# EAGLE schematic BT840F_Schematic (EAGLE 9.5.2)
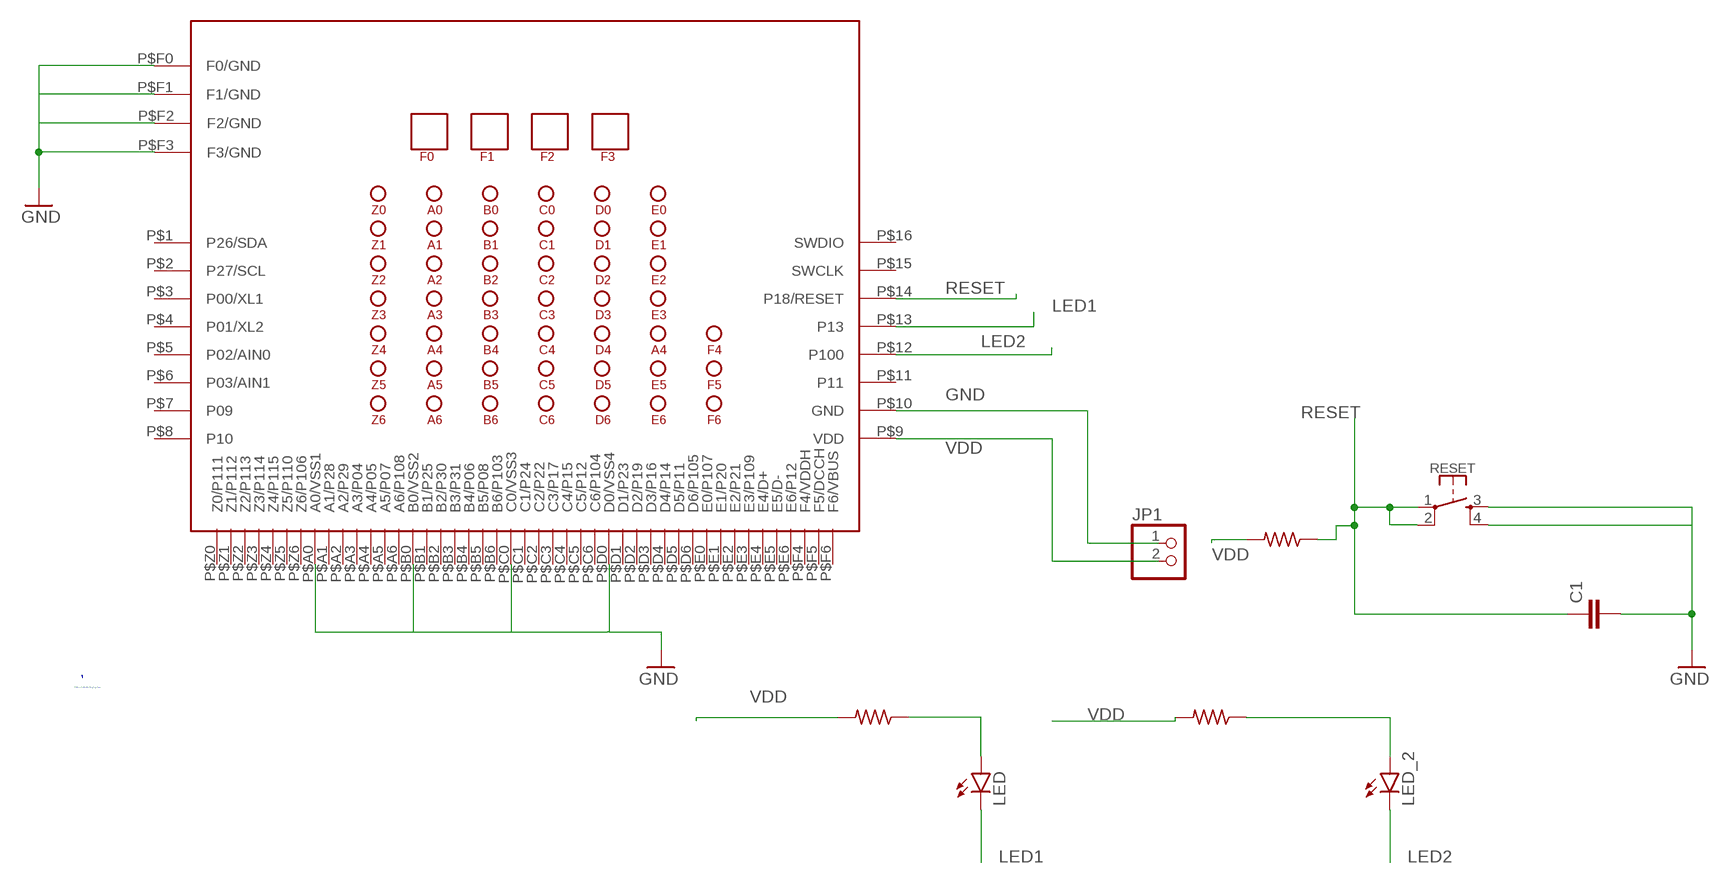
[diagram p0: schematic, sheet 1]

## Parts
C1  C-EUC0805  [C0805]
JP1  PINHD-1X2  [1X02]
LED  LEDCHIP-LED0805  [CHIP-LED0805]
LED_2  LEDCHIP-LED0805  [CHIP-LED0805]
R_LED1  4.7k  R-US_R0805  [R0805]
R_LED2  4.7k  R-US_R0805  [R0805]
R_RESET  4.7k  R-US_R0805  [R0805]
RESET  MOMENTARY-SWITCH-SPST-2-SMD-4.6X2.8MM  [TACTILE_SWITCH_SMD_4.6X2.8MM]
U1  BT840  [BT840]

## Nets
GND: C1.2 JP1.1 RESET.3 RESET.4 U1.P$10(GND) U1.P$A0(A0/VSS1) U1.P$B0(B0/VSS2) U1.P$C0(C0/VSS3) U1.P$D0(D0/VSS4) U1.P$F0(F0/GND) U1.P$F1(F1/GND) U1.P$F2(F2/GND) U1.P$F3(F3/GND)
LED1: LED.C U1.P$13(P13)
LED2: LED_2.C U1.P$12(P100)
N$2: LED_2.A R_LED2.1
N$3: LED.A R_LED1.1
RESET: C1.1 R_RESET.1 RESET.1 RESET.2 U1.P$14(P18/RESET)
VDD: JP1.2 R_LED1.2 R_LED2.2 R_RESET.2 U1.P$9(VDD)
Unconnected: U1.P$1(P26/SDA) U1.P$2(P27/SCL) U1.P$3(P00/XL1) U1.P$4(P01/XL2) U1.P$5(P02/AIN0) U1.P$6(P03/AIN1) U1.P$7(P09) U1.P$8(P10) U1.P$11(P11) U1.P$15(SWCLK) U1.P$16(SWDIO) U1.P$A1(A1/P28) U1.P$A2(A2/P29) U1.P$A3(A3/P04) U1.P$A4(A4/P05) U1.P$A5(A5/P07) U1.P$A6(A6/P108) U1.P$B1(B1/P25) U1.P$B2(B2/P30) U1.P$B3(B3/P31) U1.P$B4(B4/P06) U1.P$B5(B5/P08) U1.P$B6(B6/P103) U1.P$C1(C1/P24) U1.P$C2(C2/P22) U1.P$C3(C3/P17) U1.P$C4(C4/P15) U1.P$C5(C5/P12) U1.P$C6(C6/P104) U1.P$D1(D1/P23) U1.P$D2(D2/P19) U1.P$D3(D3/P16) U1.P$D4(D4/P14) U1.P$D5(D5/P11) U1.P$D6(D6/P105) U1.P$E0(E0/P107) U1.P$E1(E1/P20) U1.P$E2(E2/P21) U1.P$E3(E3/P109) U1.P$E4(E4/D+) U1.P$E5(E5/D-) U1.P$E6(E6/P12) U1.P$F4(F4/VDDH) U1.P$F5(F5/DCCH) U1.P$F6(F6/VBUS) U1.P$Z0(Z0/P111) U1.P$Z1(Z1/P112) U1.P$Z2(Z2/P113) U1.P$Z3(Z3/P114) U1.P$Z4(Z4/P115) U1.P$Z5(Z5/P110) U1.P$Z6(Z6/P106)

## Notes on the sheet
- C:/Users/ender/Desktop/logo.bmp

## Library data of the parts
C1 = rcl:C-EU: CAPACITOR, European symbol; SPICEPREFIX: C
JP1 = pinhead:PINHD-1X2: PIN HEADER
LED LED_2 = led:LED: LED OSRAM: - CHIPLED LG R971, LG N971, LY N971, LG Q971, LY Q971, LO R971, LY R971 LH N974, LH R974 LS Q976, LO Q976, LY Q976 LO Q996 - Hyper CHIPLED LW Q18S LB Q993, LB Q99A, LB R99A - SideLED LS A670, LO A670, LY A670, LG A670, LP A670 LB A673, LV A673, LT A673, LW A673 LH A674 LY A675 LS A676, LA A676, LO A676, LY A676, LW A676 LS A679, LY A679, LG A679 - Hyper Micro SIDELED® LS Y876, LA Y876, LO Y876, LY Y876 LT Y87S - SmartLED LW L88C, LW L88S LB L89C, LB L89S, LG L890 LS L89K, LO L89K, LY L89K LS L896, LA L896, LO L896, LY L896 - TOPLED LS T670, LO T670, LY T670, LG T670, LP T670 LSG T670, LSP T670, LSY T670, LOP T670, LYG T670 LG T671, LOG T671, LSG T671 LB T673, LV T673, LT T673, LW T673 LH T674 LS T676, LA T676, LO T676, LY T676, LB T676, LH T676, LSB T676, LW T676 LB T67C, LV T67C, LT T67C, LS T67K, LO T67K, LY T67K, LW E67C LS E67B, LA E67B, LO E67B, LY E67B, LB E67C, LV E67C, LT E67C LW T67C LS T679, LY T679, LG T679 LS T770, LO T770, LY T770, LG T770, LP T770 LB T773, LV T773, LT T773, LW T773 LH T774 LS E675, LA E675, LY E675, LS T675 LS T776, LA T776, LO T776, LY T776, LB T776 LHGB T686 LT T68C, LB T68C - Hyper Mini TOPLED® LB M676 - Mini TOPLED Santana® LG M470 LS M47K, LO M47K, LY M47K Source: http://www.osram.convergy.de LUXEON: - LUMILED® LXK2-PW12-R00, LXK2-PW12-S00, LXK2-PW14-U00, LXK2-PW14-V00 LXK2-PM12-R00, LXK2-PM12-S00, LXK2-PM14-U00 LXK2-PE12-Q00, LXK2-PE12-R00, LXK2-PE12-S00, LXK2-PE14-T00, LXK2-PE14-U00 LXK2-PB12-K00, LXK2-PB12-L00, LXK2-PB12-M00, LXK2-PB14-N00, LXK2-PB14-P00, LXK2-PB14-Q00 LXK2-PR12-L00, LXK2-PR12-M00, LXK2-PR14-Q00, LXK2-PR14-R00 LXK2-PD12-Q00, LXK2-PD12-R00, LXK2-PD12-S00 LXK2-PH12-R00, LXK2-PH12-S00 LXK2-PL12-P00, LXK2-PL12-Q00, LXK2-PL12-R00 Source: www.luxeon.com KINGBRIGHT: KA-3528ASYC Source: www.kingbright.com
R_LED1 R_LED2 R_RESET = adafruit:R-US_: RESISTOR, American symbol
RESET = SparkFun-Switches:MOMENTARY-SWITCH-SPST-2: Momentary Switch (Pushbutton) - SPST - Two Circuits Normally-open (NO) SPST momentary switches (buttons, pushbuttons). Schematic symbol includes two switch circuits. Variants SMD-4.6MMX2.8MM - 4.60mm x 2.80mm Tactile Momentary Button Switch - Used on SparkFun SAMD21 Mini Breakout <https://www.sparkfun.com/products/13664> SMD-5.2MM - Mini Pushbutton Switch - SMD <https://www.sparkfun.com/products/8720> - Used on Arduino Pro Mini <https://www.sparkfun.com/products/11114>; PROD_ID: SWCH-13065
U1 = BT840F:BT840